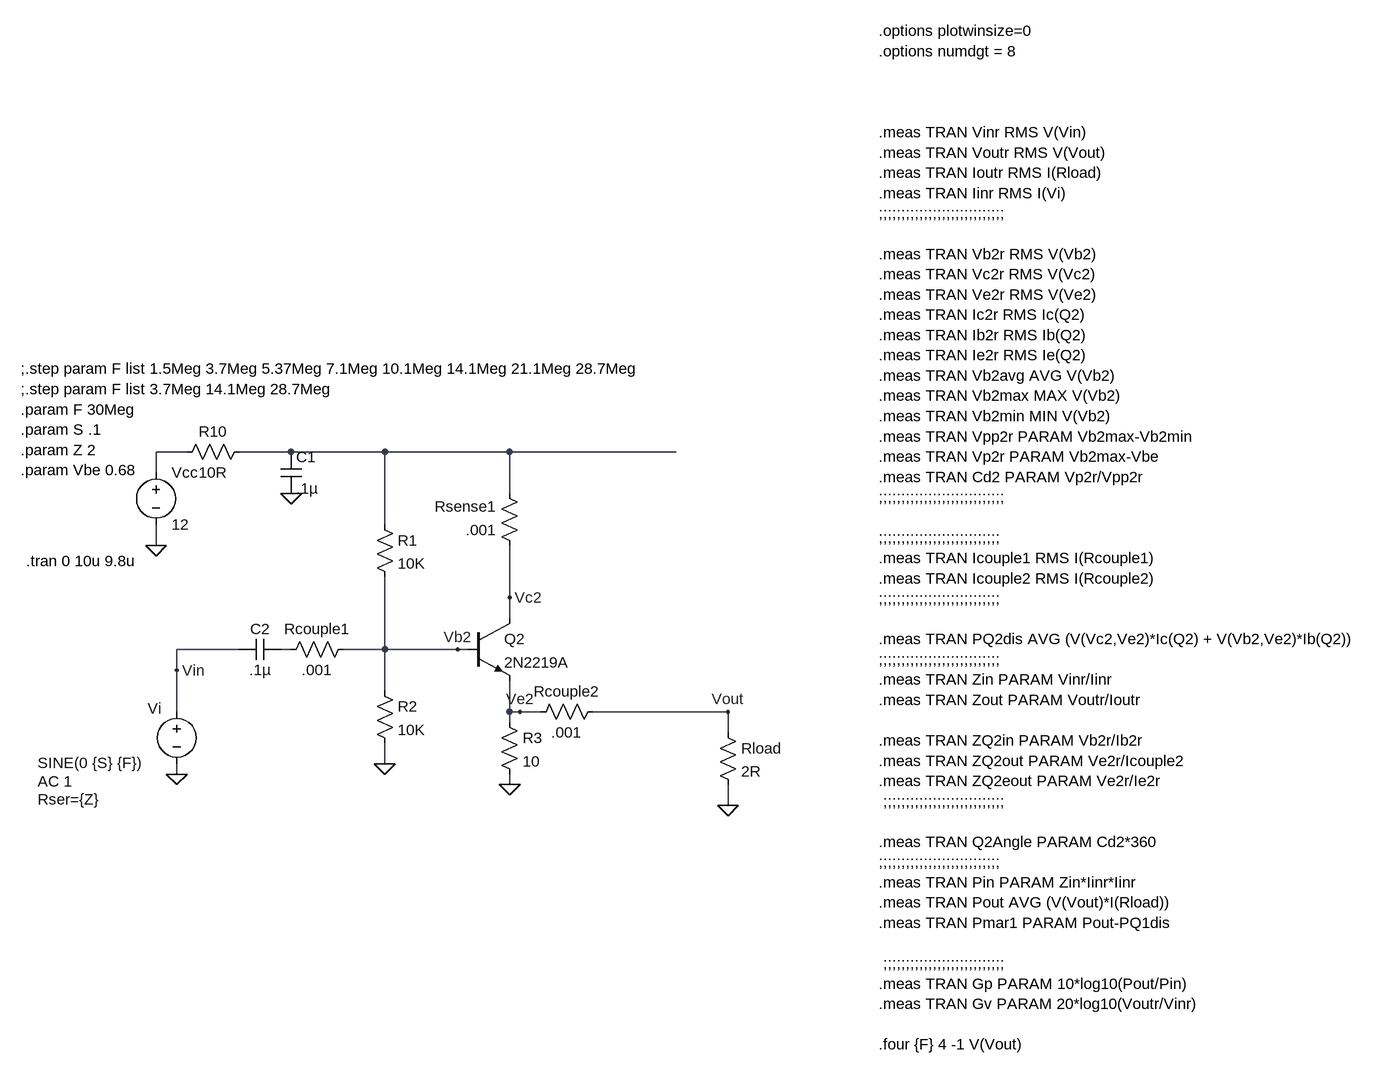
[diagram p0: schematic Common Collector Amp Testing 2.asc]
Common Collector Amp Testing 2.asc, the LTspice schematic file:
Version 4
SHEET 1 2140 1880
WIRE -32 -32 -80 -32
WIRE 128 -32 48 -32
WIRE 272 -32 128 -32
WIRE 464 -32 272 -32
WIRE 720 -32 464 -32
WIRE -80 0 -80 -32
WIRE 464 32 464 -32
WIRE 272 80 272 -32
WIRE -80 112 -80 80
WIRE 464 192 464 112
WIRE 464 224 464 192
WIRE 48 272 -48 272
WIRE 128 272 112 272
WIRE 272 272 272 160
WIRE 272 272 208 272
WIRE 384 272 272 272
WIRE 400 272 384 272
WIRE -48 304 -48 272
WIRE 272 336 272 272
WIRE -48 368 -48 304
WIRE 464 368 464 320
WIRE 480 368 464 368
WIRE 512 368 480 368
WIRE 800 368 592 368
WIRE 464 384 464 368
WIRE 800 400 800 368
WIRE 272 448 272 416
WIRE -48 464 -48 448
WIRE 464 480 464 464
WIRE 800 512 800 480
FLAG 464 480 0
FLAG -80 112 0
FLAG -48 464 0
FLAG -48 304 Vin
FLAG 384 272 Vb2
FLAG 464 192 Vc2
FLAG 480 368 Ve2
FLAG 800 512 0
FLAG 800 368 Vout
FLAG 128 32 0
FLAG 272 448 0
SYMBOL voltage -80 -16 R0
WINDOW 123 0 0 Left 0
WINDOW 39 0 0 Left 0
SYMATTR InstName Vcc
SYMATTR Value 12
SYMBOL res 448 368 R0
SYMATTR InstName R3
SYMATTR Value 10
SYMBOL npn 400 224 R0
SYMATTR InstName Q2
SYMATTR Value 2N2219A
SYMBOL res 784 384 R0
SYMATTR InstName Rload
SYMATTR Value 2R
SYMBOL res 64 -48 R90
WINDOW 0 0 56 VBottom 2
WINDOW 3 32 56 VTop 2
SYMATTR InstName R10
SYMATTR Value 10R
SYMBOL res 224 256 R90
WINDOW 0 0 56 VBottom 2
WINDOW 3 32 56 VTop 2
SYMATTR InstName Rcouple1
SYMATTR Value .001
SYMBOL res 608 352 R90
WINDOW 0 0 56 VBottom 2
WINDOW 3 32 56 VTop 2
SYMATTR InstName Rcouple2
SYMATTR Value .001
SYMBOL voltage -48 352 R0
WINDOW 0 -45 11 Left 2
WINDOW 3 -214 95 Left 2
WINDOW 123 -214 123 Left 2
WINDOW 39 -214 151 Left 2
SYMATTR InstName Vi
SYMATTR Value SINE(0 {S} {F})
SYMATTR Value2 AC 1
SYMATTR SpiceLine Rser={Z}
SYMBOL res 480 128 R180
WINDOW 0 36 76 Left 2
WINDOW 3 36 40 Left 2
SYMATTR InstName Rsense1
SYMATTR Value .001
SYMBOL cap 112 -32 R0
SYMATTR InstName C1
SYMATTR Value .1µ
SYMBOL cap 112 256 R90
WINDOW 0 0 32 VBottom 2
WINDOW 3 32 32 VTop 2
SYMATTR InstName C2
SYMATTR Value .1µ
SYMBOL res 256 64 R0
SYMATTR InstName R1
SYMATTR Value 10K
SYMBOL res 256 320 R0
SYMATTR InstName R2
SYMATTR Value 10K
TEXT 1032 -680 Left 2 !.options plotwinsize=0\n.options numdgt = 8\n \n \n \n.meas TRAN Vinr RMS V(Vin)\n.meas TRAN Voutr RMS V(Vout)\n.meas TRAN Ioutr RMS I(Rload)\n.meas TRAN Iinr RMS I(Vi)\n;;;;;;;;;;;;;;;;;;;;;;;;;;;;\n \n.meas TRAN Vb2r RMS V(Vb2)\n.meas TRAN Vc2r RMS V(Vc2)\n.meas TRAN Ve2r RMS V(Ve2)\n.meas TRAN Ic2r RMS Ic(Q2)\n.meas TRAN Ib2r RMS Ib(Q2)\n.meas TRAN Ie2r RMS Ie(Q2)\n.meas TRAN Vb2avg AVG V(Vb2)\n.meas TRAN Vb2max MAX V(Vb2)\n.meas TRAN Vb2min MIN V(Vb2)\n.meas TRAN Vpp2r PARAM Vb2max-Vb2min\n.meas TRAN Vp2r PARAM Vb2max-Vbe\n.meas TRAN Cd2 PARAM Vp2r/Vpp2r\n;;;;;;;;;;;;;;;;;;;;;;;;;;;;\n \n;;;;;;;;;;;;;;;;;;;;;;;;;;;\n.meas TRAN Icouple1 RMS I(Rcouple1)\n.meas TRAN Icouple2 RMS I(Rcouple2)\n;;;;;;;;;;;;;;;;;;;;;;;;;;;\n \n.meas TRAN PQ2dis AVG (V(Vc2,Ve2)*Ic(Q2) + V(Vb2,Ve2)*Ib(Q2))\n;;;;;;;;;;;;;;;;;;;;;;;;;;;\n.meas TRAN Zin PARAM Vinr/Iinr\n.meas TRAN Zout PARAM Voutr/Ioutr \n \n.meas TRAN ZQ2in PARAM Vb2r/Ib2r \n.meas TRAN ZQ2out PARAM Ve2r/Icouple2\n.meas TRAN ZQ2eout PARAM Ve2r/Ie2r\n ;;;;;;;;;;;;;;;;;;;;;;;;;;;\n \n.meas TRAN Q2Angle PARAM Cd2*360\n;;;;;;;;;;;;;;;;;;;;;;;;;;;\n.meas TRAN Pin PARAM Zin*Iinr*Iinr\n.meas TRAN Pout AVG (V(Vout)*I(Rload))\n.meas TRAN Pmar1 PARAM Pout-PQ1dis\n \n ;;;;;;;;;;;;;;;;;;;;;;;;;;;\n.meas TRAN Gp PARAM 10*log10(Pout/Pin)\n.meas TRAN Gv PARAM 20*log10(Voutr/Vinr)\n \n.four {F} 4 -1 V(Vout)
TEXT -280 136 Left 2 !.tran 0 10u 9.8u
TEXT -288 -160 Left 2 !;.step param F list 1.5Meg 3.7Meg 5.37Meg 7.1Meg 10.1Meg 14.1Meg 21.1Meg 28.7Meg\n;.step param F list 3.7Meg 14.1Meg 28.7Meg\n.param F 30Meg\n.param S .1\n.param Z 2\n.param Vbe 0.68

The netlist it stands for:
* Common Collector Amp Testing 2.asc
Vcc N001 0 12
R3 Ve2 0 10
Q2 Vc2 Vb2 Ve2 0 2N2219A
Rload Vout 0 2R
R10 N002 N001 10R
Rcouple1 Vb2 N003 .001
Rcouple2 Vout Ve2 .001
Vi Vin 0 SINE(0 {S} {F}) AC 1 Rser={Z}
Rsense1 Vc2 N002 .001
C1 N002 0 .1µ
C2 N003 Vin .1µ
R1 N002 Vb2 10K
R2 Vb2 0 10K
.model NPN NPN
.model PNP PNP
.lib standard.bjt
.options plotwinsize=0
.options numdgt = 8
.meas TRAN Vinr RMS V(Vin)
.meas TRAN Voutr RMS V(Vout)
.meas TRAN Ioutr RMS I(Rload)
.meas TRAN Iinr RMS I(Vi)
;;;;;;;;;;;;;;;;;;;;;;;;;;;;
.meas TRAN Vb2r RMS V(Vb2)
.meas TRAN Vc2r RMS V(Vc2)
.meas TRAN Ve2r RMS V(Ve2)
.meas TRAN Ic2r RMS Ic(Q2)
.meas TRAN Ib2r RMS Ib(Q2)
.meas TRAN Ie2r RMS Ie(Q2)
.meas TRAN Vb2avg AVG V(Vb2)
.meas TRAN Vb2max MAX V(Vb2)
.meas TRAN Vb2min MIN V(Vb2)
.meas TRAN Vpp2r PARAM Vb2max-Vb2min
.meas TRAN Vp2r PARAM Vb2max-Vbe
.meas TRAN Cd2 PARAM Vp2r/Vpp2r
;;;;;;;;;;;;;;;;;;;;;;;;;;;;
;;;;;;;;;;;;;;;;;;;;;;;;;;;
.meas TRAN Icouple1 RMS I(Rcouple1)
.meas TRAN Icouple2 RMS I(Rcouple2)
;;;;;;;;;;;;;;;;;;;;;;;;;;;
.meas TRAN PQ2dis AVG (V(Vc2,Ve2)*Ic(Q2) + V(Vb2,Ve2)*Ib(Q2))
;;;;;;;;;;;;;;;;;;;;;;;;;;;
.meas TRAN Zin PARAM Vinr/Iinr
.meas TRAN Zout PARAM Voutr/Ioutr
.meas TRAN ZQ2in PARAM Vb2r/Ib2r
.meas TRAN ZQ2out PARAM Ve2r/Icouple2
.meas TRAN ZQ2eout PARAM Ve2r/Ie2r
 ;;;;;;;;;;;;;;;;;;;;;;;;;;;
.meas TRAN Q2Angle PARAM Cd2*360
;;;;;;;;;;;;;;;;;;;;;;;;;;;
.meas TRAN Pin PARAM Zin*Iinr*Iinr
.meas TRAN Pout AVG (V(Vout)*I(Rload))
.meas TRAN Pmar1 PARAM Pout-PQ1dis
 ;;;;;;;;;;;;;;;;;;;;;;;;;;;
.meas TRAN Gp PARAM 10*log10(Pout/Pin)
.meas TRAN Gv PARAM 20*log10(Voutr/Vinr)
.four {F} 4 -1 V(Vout)
.tran 0 10u 9.8u
;.step param F list 1.5Meg 3.7Meg 5.37Meg 7.1Meg 10.1Meg 14.1Meg 21.1Meg 28.7Meg
;.step param F list 3.7Meg 14.1Meg 28.7Meg
.param F 30Meg
.param S .1
.param Z 2
.param Vbe 0.68
.backanno
.end